# Altium schematic sheet Sheet1.SchDoc: =SchTitle
size 276 x 198 mm; Organization: ETML; Address1: Rue de Sébeillon12; Address2: CH - 1004 Lausanne; Address3: Tél. 021 316 77 77; Address4: www.etml.ch; SheetNumber: 1; SheetTotal: 4; Replace: .; ModA: .; ModB: .; ModC: .; ModD: .
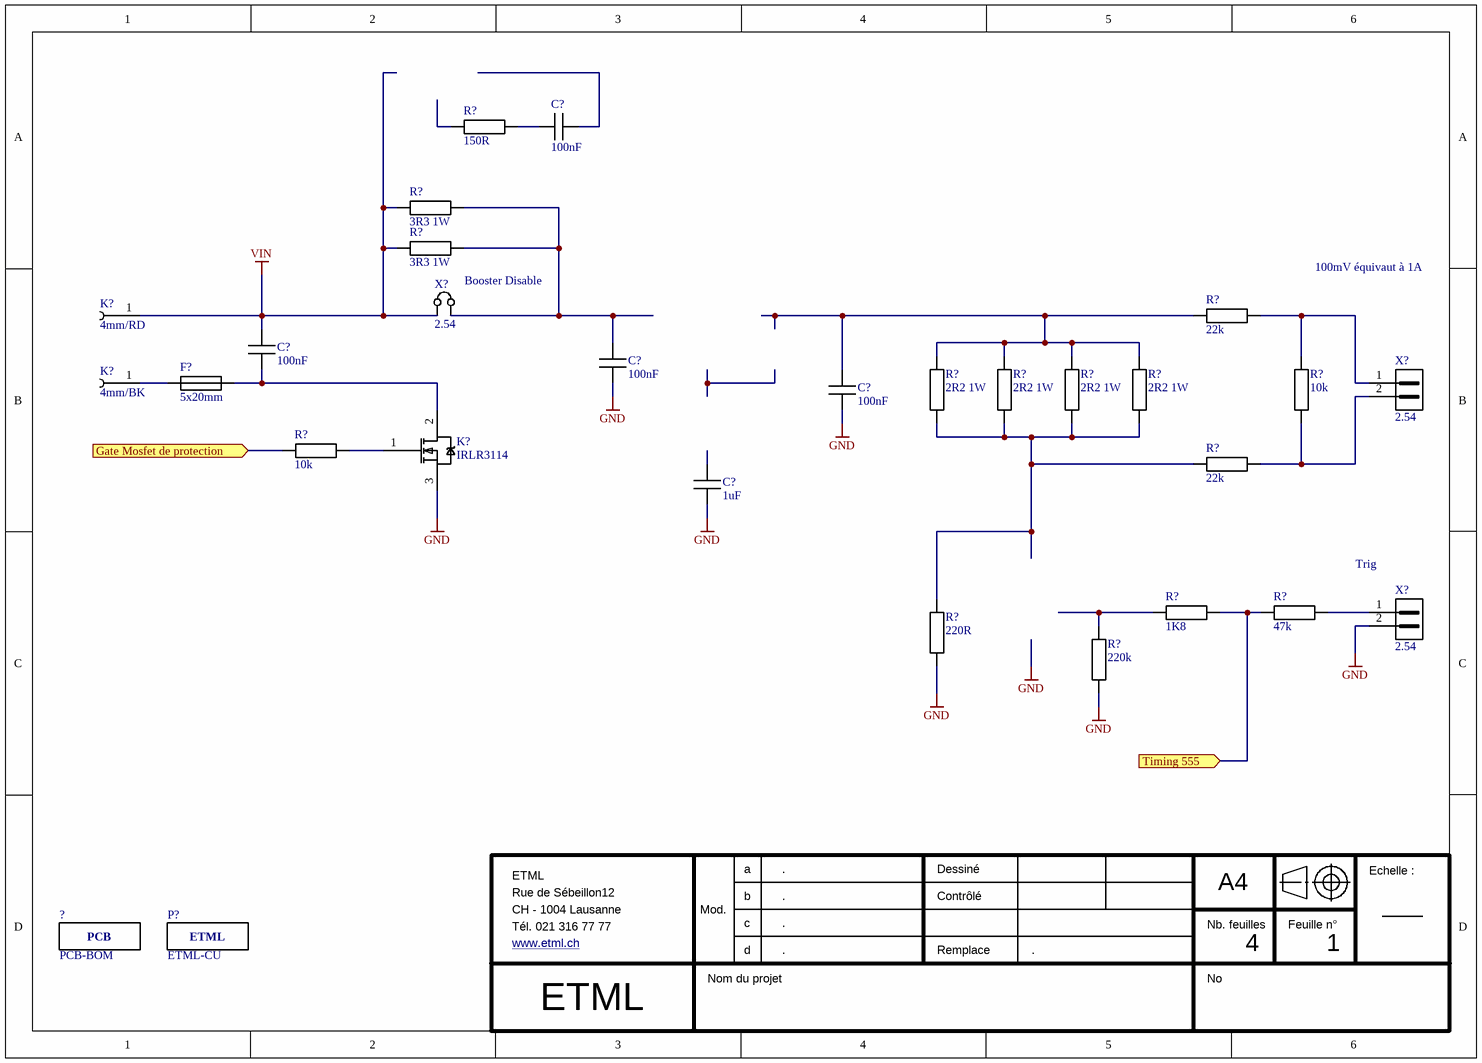
[diagram p0: Sheet1.SchDoc]

## Parts
(Parts that share a designator on the sheet are numbered #1, #2 ... from top to bottom, then left to right.)
?  PCB-BOM  (mechanical)
C?#1  100nF  [CAPC2012X08M]
C?#2  100nF  [CAPC2012X08M]
C?#3  100nF  [CAPC2012X08M]
C?#4  100nF  [CAPC2012X08M]
C?#5  1uF  [CAPC2012X08M]
F?  5x20mm  [WE_696103201002]
K?#1  4mm/RD  [SKS_973582101]
K?#2  4mm/BK  [SKS_973582100]
K?#3  IRLR3114  [DPAK228P991X238-3M]
P?  ETML-CU  [DRAW-ETML-CU]  (no BOM)
R?#1  150R  [RESC2012X06M]
R?#2  3R3 1W  [NEOHM 1W ROX1S]
R?#3  3R3 1W  [NEOHM 1W ROX1S]
R?#4  22k  [RESC2012X06M]
R?#5  2R2 1W  [NEOHM 1W ROX1S]
R?#6  2R2 1W  [NEOHM 1W ROX1S]
R?#7  2R2 1W  [NEOHM 1W ROX1S]
R?#8  2R2 1W  [NEOHM 1W ROX1S]
R?#9  10k  [RESC2012X06M]
R?#10  10k  [RESC2012X06M]
R?#11  22k  [RESC2012X06M]
R?#12  1K8  [RESC2012X06M]
R?#13  47k  [RESC2012X06M]
R?#14  220R  [RESC2012X06M]
R?#15  220k  [RESC2012X06M]
X?#1  2.54  [PIN-1x02-2.54]
X?#2  2.54  [PIN-1x02-2.54]
X?#3  2.54  [PIN-1x02-2.54]

## Ports
Gate Mosfet de protection (in), Timing 555 (in)

## Nets
GND: C?#3.1 C?#4.1 C?#5.1 K?#3.3(S) R?#14.1 R?#15.1 X?#3.2
VIN: C?#2.2 K?#1.1 R?#2.1 R?#3.1 X?#1.1
Gate Mosfet de protection: R?#10.1 ; port Gate Mosfet de protection
Timing 555: R?#12.2 R?#13.1 ; port Timing 555
NetC?#1_1: C?#1.1 R?#1.2
NetC?#2_1: C?#2.1 F?.2 K?#3.2(D)
NetC?#3_2: C?#3.2 R?#2.2 R?#3.2 X?#1.2
NetC?#4_2: C?#4.2 R?#4.1 R?#5.2 R?#6.2 R?#7.2 R?#8.2
NetF?_1: F?.1 K?#2.1
NetK?#3_1: K?#3.1(G) R?#10.2
NetR?#4_2: R?#4.2 R?#9.2 X?#2.1
NetR?#5_1: R?#5.1 R?#6.1 R?#7.1 R?#8.1 R?#11.1 R?#14.2
NetR?#9_1: R?#9.1 R?#11.2 X?#2.2
NetR?#12_1: R?#12.1 R?#15.2
NetR?#13_2: R?#13.2 X?#3.1

Not connected (* = marked no-connect by the designer): C?#1 2; C?#5 2; R?#1 1

## Notes on the sheet
- 100mV équivaut à 1A
- Booster Disable
- Trig
- a
- Dessiné
- A4
- Echelle :
- Mod.
- b
- c
- d
- Contrôlé
- Remplace
- Nb. feuilles
- Feuille n°
- Nom du projet
- No
- (in symbol CMP-064-000000-1) ETML
- (in symbol CMP-064-000001-1) PCB

## Library data of the parts
? = CMP-064-000001-1: PCB element for BOM; IsStocked: False; PN: PN-108075; Category: Others; SubCategory: Dessins; Supplier Price 1: 0; Supplier 1: Eurocircuits Sàrl; Value: PCB-BOM; Supplier Part Number 1: -
C?#1-C?#4 = CMP-065-000038-2: CAPC 100nF X7R 50V 10% 2012 (0805 INCH); Manufacturer Number: C2012X7R1H104K085AA; Manufacturer: TDK; IsStocked: 1; TemperatureRange: -55°C to +125°C; PN: PN-747862; Supplier Part Number 1: FAB.0805_C 100n; Supplier Price 1: 0.0200; Voltage: 50V; Dielectric: X7R; Value: 100nF; SubCategory: Condensateurs ceramique; Category: Passives; Tolerance: ±10%; Supplier 1: ETML
C?#5 = CMP-065-000041-2: CAPC 1uF X5R 25V 10% 2012 (0805 INCH); Manufacturer: TDK; Manufacturer Number: C2012X5R1E105K125AA; Value: 1µF; TemperatureRange: -55°C to +85°C; IsStocked: 1; PN: PN-324029; Supplier 1: ETML; Category: Passives; Supplier Part Number 1: FAB.0805_C 1u; SubCategory: Condensateurs ceramique; Tolerance: ±10%; Supplier Price 1: 0.0223; Dielectric: X5R; Voltage: 25V
F? = CMP-067-000003-1: FUSE HOLDER 5x20MM THT; Manufacturer: Würth Electronik; Manufacturer Number: 696103201002; TemperatureRange: -30°C to +120°C; Voltage: 250VAC; Current: 10A; PN: PN-533361; IsStocked: False; Supplier Part Number 1: 3517015; SubCategory: Fusibles; Value: 5x20mm; Category: Protections; Supplier 1: Farnell; Supplier Price 1: 0.954
K?#1 = CMP-054-000001-1: Embase 4mm PCB 16A 60VDC Sn Red; Manufacturer: SKS Kontakttechnik GmbH; Manufacturer Number: 973582101; TemperatureRange: -25°C to +85°C; PN: PN-628499; Dielectric: PC; IsStocked: True; Value: 4mm/RD; Supplier Price 1: 1.7; Supplier 1: ETML; Current: 16A; Voltage: 60VDC; SubCategory: Laboratoire; Category: Connectors; Supplier Part Number 1: MAG.277.666
K?#2 = CMP-054-000000-1: Embase 4mm PCB 16A 60VDC Sn Black; Manufacturer: SKS Kontakttechnik GmbH; Manufacturer Number: 973582100; Dielectric: PC; TemperatureRange: -25°C to +85°C; IsStocked: True; PN: PN-390416; SubCategory: Laboratoire; Supplier 1: ETML; Supplier Price 1: 1.51; Value: 4mm/BK; Supplier Part Number 1: MAG.277.665; Voltage: 60VDC; Current: 16A; Category: Connectors
K?#3 = INFINEON IRLR3114ZTRPBF: MOSFET de puissance, Canal N, 40 V, 42 A, 0.0039 ohm, TO-252AA, Montage en surface
P? = CMP-064-000000-1: Logo ETML; PN: PN-439033; IsStocked: False; Value: ETML-CU; SubCategory: Dessins; Category: Others
R?#1 = CMP-066-000177-2: RES 150ohm  ±1% 0.125W 2012 (0805 INCH); Manufacturer: Yageo; Manufacturer Number: RC0805FR-07150RL; Value: 150; TemperatureRange: -55°C to 155°C; Voltage: 150V; TemperatureCoeff: ±200ppm/°C; PN: PN-455993; IsStocked: 1; Supplier Price 1: 0.0200; Tolerance: ±1%; SubCategory: Resistances couche epaisse; Power: 0.125W; Supplier Part Number 1: FAB.0805_R 150R; Supplier 1: ETML; Category: Passives
R?#2 R?#3 = NEOHM - TE CONNECTIVITY ROX1SJ3R3: Résistance traversante, 3.3 ohm, ROX, 1 W, ± 5%, Axial, 350 V; Manufacturer Number: MRS25000C3308FCT00; Manufacturer: Vishay; PN: PN-918915; Voltage: 350V; Power: 0.6W; TemperatureRange: -55°C to 155°C; Value: 3.3; Tolerance: ±1%; IsStocked: 1; TemperatureCoeff: ±50ppm/°C; Supplier Price 1: 0.1500; SubCategory: Resistances film metallique; Category: Passives; Supplier 1: Farnell; Supplier 2: Mouser; Supplier 3: Digikey; Supplier Part Number 1: 3399704; Supplier Part Number 2: 279-ROX1SJ3R3; Supplier Part Number 3: A131468CT-ND
R?#4 R?#11 = CMP-066-000203-2: RES 22kohm  ±1% 0.125W 2012 (0805 INCH); Manufacturer: Yageo; Manufacturer Number: RC0805FR-0722KL; PN: PN-851075; Voltage: 150V; TemperatureCoeff: ±200ppm/°C; TemperatureRange: -55°C to 155°C; IsStocked: 1; Tolerance: ±1%; Supplier Part Number 1: FAB.0805_R 22k; SubCategory: Resistances couche epaisse; Value: 22k; Supplier Price 1: 0.0200; Supplier 1: ETML; Category: Passives; Power: 0.125W
R?#5-R?#8 = NEOHM - TE CONNECTIVITY ROX1SJ3R3_1: Résistance traversante, 2.2 ohm, ROX, 1 W, ± 5%, Axial, 350 V; Manufacturer Number: MRS25000C3308FCT00; Manufacturer: Vishay; PN: PN-918915; Voltage: 350V; Power: 0.6W; TemperatureRange: -55°C to 155°C; Value: 2.2; Tolerance: ±1%; IsStocked: 1; TemperatureCoeff: ±50ppm/°C; Supplier Price 1: 0.1500; SubCategory: Resistances film metallique; Category: Passives; Supplier 1: Farnell; Supplier 2: Mouser; Supplier 3: Digikey; Supplier Part Number 1: 3399704; Supplier Part Number 2: 279-ROX1SJ3R3; Supplier Part Number 3: A131468CT-ND
R?#9 R?#10 = CMP-066-000199-2: RES 10kohm  ±1% 0.125W 2012 (0805 INCH); Manufacturer Number: RC0805FR-0710KL; Manufacturer: Yageo; PN: PN-374909; TemperatureCoeff: ±200ppm/°C; Voltage: 150V; TemperatureRange: -55°C to 155°C; IsStocked: 1; Tolerance: ±1%; Category: Passives; Value: 10k; Supplier Price 1: 0.0200; Supplier Part Number 1: FAB.0805_R 10k; Supplier 1: ETML; SubCategory: Resistances couche epaisse; Power: 0.125W
R?#12 = CMP-066-000190-2: RES 1.8kohm  ±1% 0.125W 2012 (0805 INCH); Manufacturer Number: RC0805FR-071K8L; Manufacturer: Yageo; TemperatureRange: -55°C to 155°C; Voltage: 150V; IsStocked: 1; PN: PN-653534; TemperatureCoeff: ±200ppm/°C; Value: 1.8k; Power: 0.125W; Supplier Part Number 1: FAB.0805_R 1K8; Category: Passives; Tolerance: ±1%; Supplier Price 1: 0.0200; Supplier 1: ETML; SubCategory: Resistances couche epaisse
R?#13 = CMP-066-000207-2: RES 47kohm  ±1% 0.125W 2012 (0805 INCH); Manufacturer Number: RC0805FR-0747KL; Manufacturer: Yageo; TemperatureRange: -55°C to 155°C; Voltage: 150V; IsStocked: 1; TemperatureCoeff: ±200ppm/°C; PN: PN-427242; Category: Passives; Supplier Price 1: 0.0200; Power: 0.125W; Supplier 1: ETML; Tolerance: ±1%; SubCategory: Resistances couche epaisse; Supplier Part Number 1: FAB.0805_R 47k; Value: 47k
R?#14 = CMP-066-000179-2: RES 220ohm  ±1% 0.125W 2012 (0805 INCH); Manufacturer: Yageo; Manufacturer Number: RC0805FR-07220RL; TemperatureRange: -55°C to 155°C; Voltage: 150V; IsStocked: 1; TemperatureCoeff: ±200ppm/°C; PN: PN-694076; Value: 220; SubCategory: Resistances couche epaisse; Supplier Price 1: 0.0200; Category: Passives; Supplier Part Number 1: FAB.0805_R 220R; Supplier 1: ETML; Tolerance: ±1%; Power: 0.125W
R?#15 = CMP-066-000215-2: RES 220kohm  ±1% 0.125W 2012 (0805 INCH); Manufacturer Number: RC0805FR-07220KL; Manufacturer: Yageo; PN: PN-479575; IsStocked: 1; TemperatureCoeff: ±200ppm/°C; Voltage: 150V; TemperatureRange: -55°C to 155°C; Value: 220k; Power: 0.125W; Tolerance: ±1%; Supplier Price 1: 0.0200; SubCategory: Resistances couche epaisse; Supplier 1: ETML; Category: Passives; Supplier Part Number 1: FAB.0805_R 220k
X?#1 = CMP-054-000008-1: JUMPER 2.54 1x02; Manufacturer Number: 61303611121; Manufacturer: Würth Electronik; TemperatureRange: -40°C to +105 °C; Voltage: 250VAC; PN: PN-979323; IsStocked: True; Current: 3A; Value: 2.54; SubCategory: Jumpers; Supplier Part Number 1: MAG.283.897; Supplier 1: ETML; Supplier Price 1: 0.04; Category: Connectors
X?#2 X?#3 = CMP-055-000006-1: PIN HEADER 2.54 1x02; Manufacturer Number: 61300211121; Manufacturer: Würth Electronik; IsStocked: True; PN: PN-573903; Voltage: 250V; Current: 3A; TemperatureRange: -40°C to +105°C; Supplier Part Number 1: MAG.283.897; Supplier Price 1: 0.04; Supplier 1: ETML; SubCategory: Pin Header; Category: Connectors; Value: 2.54